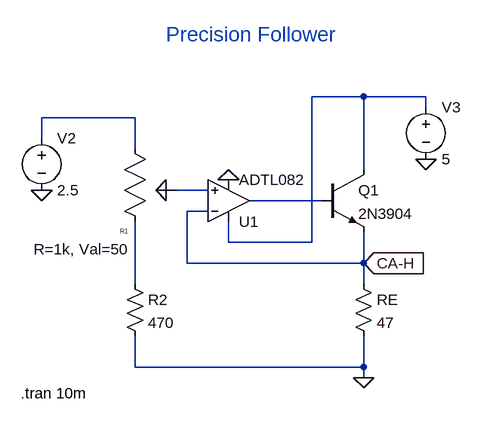
[diagram p0: schematic precision_follower_ltspice.asc]
precision_follower_ltspice.asc, the LTspice schematic file:
Version 4
SHEET 1 880 680
WIRE 448 96 368 96
WIRE 544 96 448 96
WIRE 544 112 544 96
WIRE 96 128 -48 128
WIRE -48 160 -48 128
WIRE 96 176 96 128
WIRE 448 208 448 96
WIRE 208 240 160 240
WIRE 384 256 272 256
WIRE 208 272 176 272
WIRE 240 320 240 288
WIRE 368 320 368 96
WIRE 368 320 240 320
WIRE 176 352 176 272
WIRE 448 352 448 304
WIRE 448 352 176 352
WIRE 96 384 96 288
WIRE 448 384 448 352
WIRE 96 512 96 464
WIRE 448 512 448 464
WIRE 448 512 96 512
WIRE 448 528 448 512
FLAG 240 224 0
FLAG -48 240 0
FLAG 448 528 0
FLAG 544 192 0
FLAG 448 352 CA-H
IOPIN 448 352 In
SYMBOL Opamps\\ADTL082 240 320 M180
SYMATTR InstName U1
SYMBOL potentiometer 112 272 R180
WINDOW 39 26 -59 Left 2
SYMATTR SpiceLine R=1k, Val=50
SYMATTR InstName R1
SYMBOL res 80 368 R0
SYMATTR InstName R2
SYMATTR Value 470
SYMBOL npn 384 208 R0
SYMATTR InstName Q1
SYMATTR Value 2N3904
SYMBOL res 432 368 R0
SYMATTR InstName RE
SYMATTR Value 47
SYMBOL voltage -48 144 R0
SYMATTR InstName V2
SYMATTR Value 2.5
SYMBOL voltage 544 96 R0
SYMATTR InstName V3
SYMATTR Value 5
TEXT 144 0 Left 3 ;Precision Follower
TEXT -80 552 Left 2 !.tran 10m

The netlist it stands for:
* precision_follower_ltspice.asc
XU1 N003 CA-H N001 0 N004 ADTL082  ; pins In+ In- V+ V- OUT
XR1 N005 N003 N002 potentiometer R=1k, Val=50  ; pins 1 2 3
R2 N005 0 470
Q1 N001 N004 CA-H 0 2N3904
RE CA-H 0 47
V2 N002 0 2.5
V3 N001 0 5
.model NPN NPN
.model PNP PNP
.lib standard.bjt
* Precision Follower
.tran 10m
.lib ADI.lib
.backanno
.end